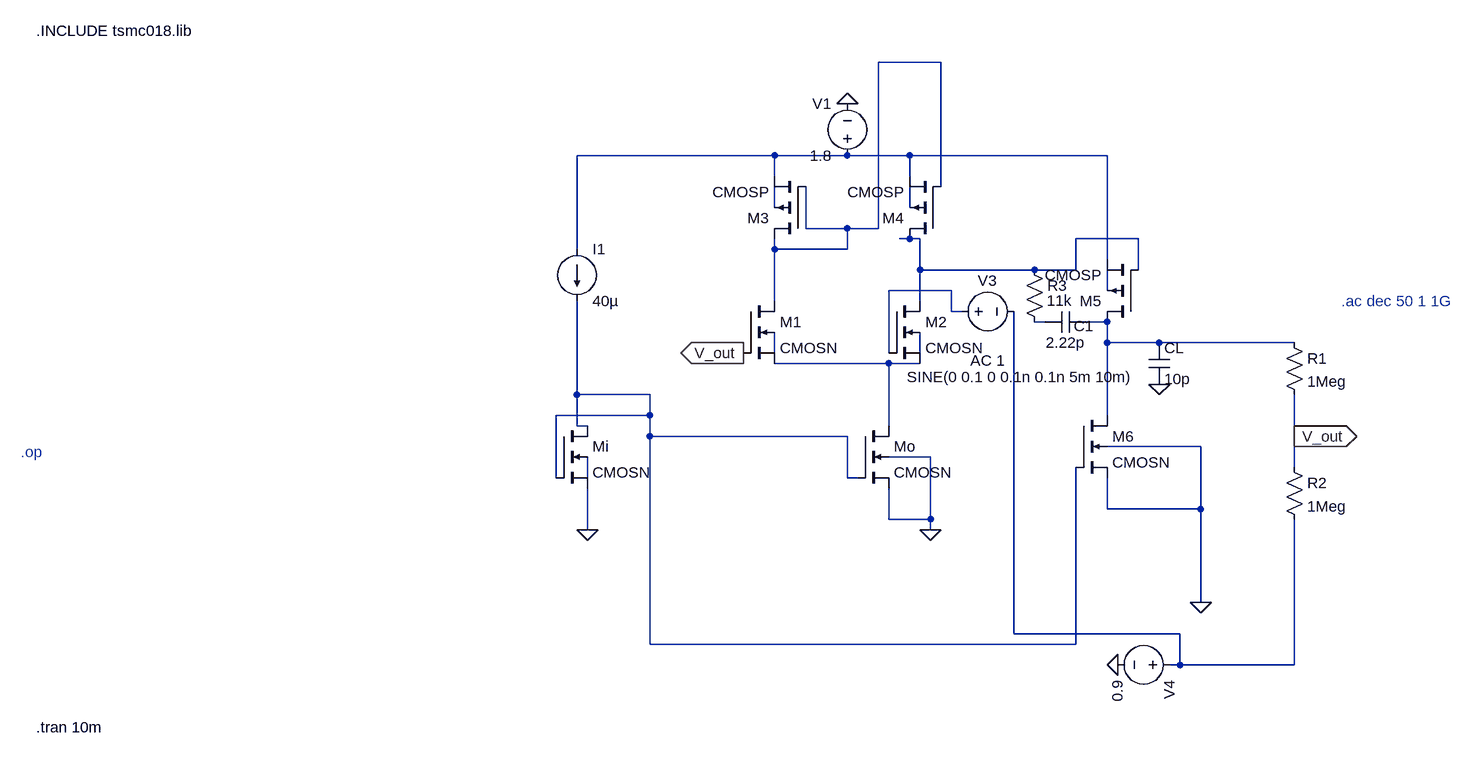
[diagram p0: schematic OTA_CLTF (2).asc]
OTA_CLTF (2).asc, the LTspice schematic file:
Version 4
SHEET 1 1508 992
WIRE 336 -48 240 -48
WIRE 80 96 -224 96
WIRE 192 96 80 96
WIRE 288 96 192 96
WIRE 592 96 288 96
WIRE 80 128 80 96
WIRE 288 128 288 96
WIRE 336 144 336 -48
WIRE 80 176 80 144
WIRE 288 176 288 144
WIRE 128 208 128 144
WIRE 192 208 128 208
WIRE 240 208 240 -48
WIRE 240 208 192 208
WIRE 288 224 272 224
WIRE 304 224 288 224
WIRE 640 224 544 224
WIRE -224 240 -224 96
WIRE 80 240 80 224
WIRE 192 240 192 208
WIRE 192 240 80 240
WIRE 592 256 592 96
WIRE 304 272 304 224
WIRE 480 272 304 272
WIRE 544 272 544 224
WIRE 544 272 480 272
WIRE 640 272 640 224
WIRE 352 304 256 304
WIRE 592 304 592 272
WIRE 80 320 80 240
WIRE 304 320 304 272
WIRE 352 336 352 304
WIRE 368 336 352 336
WIRE 496 352 480 352
WIRE 592 352 560 352
WIRE 592 384 592 352
WIRE 672 384 592 384
WIRE 880 384 672 384
WIRE 80 400 80 368
WIRE 256 400 256 304
WIRE 304 400 304 368
WIRE 256 416 80 416
WIRE 304 416 256 416
WIRE -224 464 -224 320
WIRE -112 464 -224 464
WIRE -112 496 -112 464
WIRE -112 496 -256 496
WIRE 592 496 592 384
WIRE -224 512 -224 464
WIRE -208 512 -224 512
WIRE 256 512 256 416
WIRE -112 528 -112 496
WIRE 192 528 -112 528
WIRE 880 528 880 464
WIRE 736 544 592 544
WIRE 320 560 256 560
WIRE 880 576 880 528
WIRE -256 592 -256 496
WIRE -208 592 -208 560
WIRE 192 592 192 528
WIRE 208 592 192 592
WIRE 592 640 592 592
WIRE 736 640 736 544
WIRE 736 640 592 640
WIRE 256 656 256 608
WIRE 320 656 320 560
WIRE 320 656 256 656
WIRE -208 672 -208 608
WIRE 320 672 320 656
WIRE 736 784 736 640
WIRE 448 832 448 336
WIRE 704 832 448 832
WIRE -112 848 -112 528
WIRE 544 848 544 576
WIRE 544 848 -112 848
WIRE 704 880 704 832
WIRE 704 880 688 880
WIRE 880 880 880 656
WIRE 880 880 704 880
FLAG -208 672 0
FLAG 192 16 0
FLAG 672 448 0
FLAG 736 784 0
FLAG 320 672 0
FLAG 608 880 0
FLAG 880 528 V_out
IOPIN 880 528 Out
FLAG 32 400 V_out
IOPIN 32 400 Out
SYMBOL voltage 192 112 R180
WINDOW 0 24 96 Left 2
WINDOW 3 24 16 Left 2
WINDOW 123 0 0 Left 0
WINDOW 39 0 0 Left 0
SYMATTR InstName V1
SYMATTR Value 1.8
SYMBOL cmosp 128 224 R180
SYMATTR InstName M3
SYMATTR Value2 l=0.9u w=9u
SYMBOL cmosp 336 224 R180
SYMATTR InstName M4
SYMATTR Value2 l=0.9u w=9u
SYMBOL cmosp 640 352 R180
SYMATTR InstName M5
SYMATTR Value2 l=0.9u w=16.29u
SYMBOL cmosn 32 320 R0
SYMATTR InstName M1
SYMATTR Value2 l=0.9u w=3.913u
SYMBOL cmosn 256 320 R0
SYMATTR InstName M2
SYMATTR Value2 l=0.9u w=3.913u
SYMBOL cmosn 208 512 R0
SYMATTR InstName Mo
SYMATTR Value2 l=0.7u w=8.8264u
SYMBOL cmosn -256 512 R0
SYMATTR InstName Mi
SYMATTR Value2 l=0.9u w=7.8264u
SYMBOL cmosn 544 496 R0
SYMATTR InstName M6
SYMATTR Value2 l=0.9u w=8.8264u
SYMBOL current -224 240 R0
WINDOW 123 0 0 Left 0
WINDOW 39 0 0 Left 0
SYMATTR InstName I1
SYMATTR Value 40µ
SYMBOL voltage 352 336 R270
WINDOW 0 32 56 VTop 2
WINDOW 3 -85 106 VBottom 2
WINDOW 123 -60 56 VBottom 2
WINDOW 39 0 0 Left 0
SYMATTR InstName V3
SYMATTR Value SINE(0 0.1 0 0.1n 0.1n 5m 10m)
SYMATTR Value2 AC 1
SYMBOL voltage 704 880 R90
WINDOW 123 0 0 Left 0
WINDOW 39 0 0 Left 0
SYMATTR InstName V4
SYMATTR Value 0.9
SYMBOL cap 656 384 R0
SYMATTR InstName CL
SYMATTR Value 10p
SYMBOL res 464 256 R0
WINDOW 3 35 63 Left 2
SYMATTR Value 11k
SYMATTR InstName R3
SYMBOL cap 560 336 R90
WINDOW 0 38 4 VBottom 2
WINDOW 3 32 32 VTop 2
SYMATTR InstName C1
SYMATTR Value 2.22p
SYMBOL res 864 368 R0
SYMATTR InstName R1
SYMATTR Value 1Meg
SYMBOL res 864 560 R0
SYMATTR InstName R2
SYMATTR Value 1Meg
TEXT -1056 -96 Left 2 !.INCLUDE tsmc018.lib
TEXT -1056 976 Left 2 !.tran 10m
TEXT 952 320 Left 2 ;.ac dec 50 1 1G
TEXT -1080 552 Left 2 ;.op

The netlist it stands for:
* OTA_CLTF (2).asc
V1 N002 0 1.8
M3 N001 N001 N002 N003 CMOSP l=0.9u w=9u
M4 N005 N001 N002 N004 CMOSP l=0.9u w=9u
M5 N009 N005 N002 N007 CMOSP l=0.9u w=16.29u
M1 N001 V_out N012 N010 CMOSN l=0.9u w=3.913u
M2 N005 N006 N012 N011 CMOSN l=0.9u w=3.913u
Mo N012 N013 0 0 CMOSN l=0.7u w=8.8264u
Mi N013 N013 0 N014 CMOSN l=0.9u w=7.8264u
M6 N009 N013 0 0 CMOSN l=0.9u w=8.8264u
I1 N002 N013 40µ
V3 N006 N015 SINE(0 0.1 0 0.1n 0.1n 5m 10m) AC 1
V4 N015 0 0.9
CL N009 0 10p
R3 N005 N008 11k
C1 N009 N008 2.22p
R1 N009 V_out 1Meg
R2 V_out N015 1Meg
.model NMOS NMOS
.model PMOS PMOS
.lib standard.mos
.INCLUDE tsmc018.lib
.tran 10m
* .ac dec 50 1 1G
* .op
.backanno
.end